# Altium schematic sheet Блок3.SchDoc
size A4
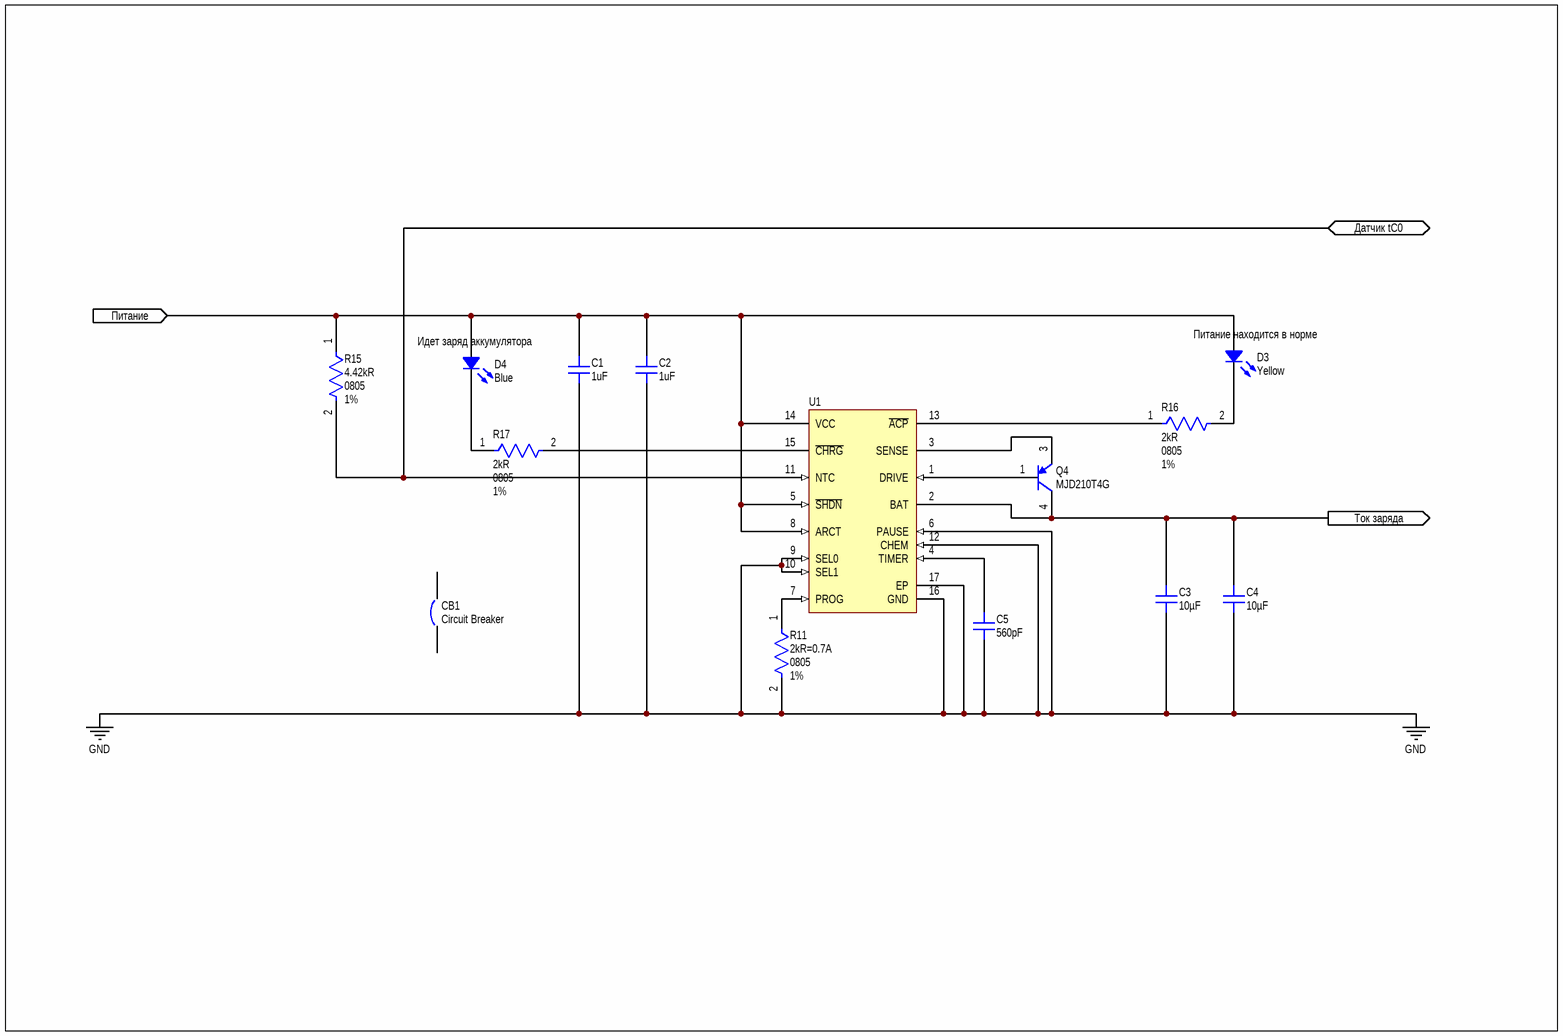
[diagram p0: Блок3.SchDoc]

## Parts
C1  1uF  [CAP 1206_3216 - 1.2MM]
C2  1uF  [CAP 1206_3216 - 1.2MM]
C3  10µF  [CAP 1206_3216 - 1.0MM]
C4  10µF  [CAP 1206_3216 - 1.0MM]
C5  560pF  [CAP 1206_3216 - 0.8MM]
CB1  Circuit Breaker  [SPST-2]
D3  Yellow  Parameter 1: Питание находится в норме  [LED 1206_3216 YELLOW]
D4  Blue  Parameter 1: Идет заряд аккумулятора  [LED 1206_3216 BLUE]
Q4  MJD210T4G  [ONSC-DPAK-3-369C-01_V]
R11  Resistance: 2kR=0.7A  Case/Package: 0805  Tolerance: 1%  [FP-MC01W0805-IPC_C]  (hidden comment: MC01W0805110K)
R15  Resistance: 4.42kR  Case/Package: 0805  Tolerance: 1%  [FP-MC01W0805-IPC_C]  (hidden comment: MC01W0805110K)
R16  Resistance: 2kR  Case/Package: 0805  Tolerance: 1%  [FP-MC01W0805-IPC_C]  (hidden comment: MC01W0805110K)
R17  Resistance: 2kR  Case/Package: 0805  Tolerance: 1%  [FP-MC01W0805-IPC_C]  (hidden comment: MC01W0805110K)
U1  LTC4060EDHC#PBF  [LT-DHC-16_V]  (value not drawn)

## Ports
Датчик tC0 (bidir), Питание (in), Ток заряда (out)

## Nets
GND: C1.1 C2.1 C3.1 C4.1 C5.1 R11.2 U1.6(PAUSE) U1.9(SEL0) U1.10(SEL1) U1.12(CHEM) U1.16(GND) U1.17(EP)
Датчик tC0: R15.2 U1.11(NTC) ; port Датчик tC0
Питание: C1.2 C2.2 D3.1 D4.1 R15.1 U1.5(~{SHDN}) U1.8(ARCT) U1.14(VCC) ; port Питание
Ток заряда: C3.2 C4.2 Q4.4(C) U1.2(BAT) ; port Ток заряда
NetC5_2: C5.2 U1.4(TIMER)
NetD3_2: D3.2 R16.2
NetD4_2: D4.2 R17.1
NetQ4_1: Q4.1(B) U1.1(DRIVE)
NetQ4_3: Q4.3(E) U1.3(SENSE)
NetR11_1: R11.1 U1.7(PROG)
NetR16_1: R16.1 U1.13(~{ACP})
NetR17_2: R17.2 U1.15(~{CHRG})

Not connected (* = marked no-connect by the designer): CB1 1 2

## Library data of the parts
C1 C2 = C1206C105M5RACTU: CAP CER 1UF 50V X7R 1206; Manufacturer: KEMET; Capacitance: 1µF; Tolerance: ±20%; Part Number: C1206C105M5RACTU; Value: 1uF; Applications: Bypass, Decoupling; ComponentLink1Description: Datasheet; ComponentLink1URL: https://api.kemet.com/component-edge/download/datasheet/C1206C105M5RACTU.pdf; ComponentLink2Description: DigiKey Link; ComponentLink2URL: http://digikey.com/product-detail/en/kemet/C1206C105M5RACTU/399-8151-1-ND/3471874; Device Package: 1206 (3216 Metric); LastUpdated: 02.09.2020 1:05:10; Lifecycle Status: Active; Minimum Order: 1; Mounting Type: Surface Mount, MLCC; Operating Temperature: -55°C ~ 125°C; Package / Case: 1206 (3216 Metric); Packaging: TapeAndReel; PartId: 18886; Part Status: Active; Price: 0.07; Series: SMD Comm X7R; Size / Dimension: 0.126" L x 0.063" W (3.20mm x 1.60mm); Supplier 1: DigiKey; Supplier Part Number 1: 399-8151-1-ND; Temperature Coefficient: X7R; Thickness (Max): 0.043" (1.10mm); Voltage - Rated: 50V
C3 C4 = EMK316BJ106MD-T: CAP CER 10UF 16V X5R 1206; Manufacturer: Taiyo Yuden; Tolerance: ±20%; Part Number: EMK316BJ106MD-T; Value: 10µF; Applications: General Purpose; Capacitance: 10µF; ComponentLink1Description: Datasheet; ComponentLink1URL: http://www.yuden.co.jp/productdata/catalog/mlcc06_e.pdf; ComponentLink2Description: DigiKey Link; ComponentLink2URL: http://digikey.com/product-detail/en/taiyo-yuden/EMK316BJ106MD-T/587-4881-1-ND/6563724; Device Package: 1206 (3216 Metric); LastUpdated: 02.09.2020 1:05:06; Lifecycle Status: Active; Minimum Order: 1; Mounting Type: Surface Mount, MLCC; Operating Temperature: -55°C ~ 85°C; Package / Case: 1206 (3216 Metric); Packaging: TapeAndReel; PartId: 18996; Part Status: Active; Price: 0.05; Series: M; Size / Dimension: 0.126" L x 0.063" W (3.20mm x 1.60mm); Supplier 1: DigiKey; Supplier Part Number 1: 587-4881-1-ND; Temperature Coefficient: X5R; Thickness (Max): 0.037" (0.95mm); Voltage - Rated: 16V
C5 = CC1206JRNPO9BN561: CAP CER 560PF 50V NPO 1206; Manufacturer: Yageo; Temperature Coefficient: C0G, NP0; Tolerance: ±5%; Part Number: CC1206JRNPO9BN561; Value: 560pF; Applications: General Purpose; Capacitance: 560pF; ComponentLink1Description: Datasheet; ComponentLink1URL: https://www.yageo.com/upload/media/product/productsearch/datasheet/mlcc/UPY-GP_NP0_16V-to-50V_17.pdf; ComponentLink2Description: DigiKey Link; ComponentLink2URL: http://digikey.com/product-detail/en/yageo/CC1206JRNPO9BN561/311-4422-1-ND/8025511; Device Package: 1206 (3216 Metric); LastUpdated: 02.09.2020 1:04:45; Lifecycle Status: Active; Minimum Order: 1; Mounting Type: Surface Mount, MLCC; Operating Temperature: -55°C ~ 125°C; Package / Case: 1206 (3216 Metric); Packaging: TapeAndReel; PartId: 18850; Part Status: Active; Price: 0.05; Series: CC; Size / Dimension: 0.126" L x 0.063" W (3.20mm x 1.60mm); Supplier 1: DigiKey; Supplier Part Number 1: 311-4422-1-ND; Thickness (Max): 0.028" (0.70mm); Voltage - Rated: 50V
D3 = APTD3216SYCK: LED YELLOW CLEAR 2SMD; Manufacturer: Kingbright; Configuration: Standard; Current - Test: 20mA; Lens Color: Colorless; Lens Size: 1.60mm Dia; Lens Style: Round with Domed Top; Millicandela Rating: 800mcd; Viewing Angle: 35°; Voltage - Forward (Vf) (Typ): 2V; Wavelength - Dominant: 590nm; Part Number: APTD3216SYCK; Color: Yellow; ComponentLink1Description: Datasheet; ComponentLink1URL: http://www.kingbrightusa.com/images/catalog/SPEC/APTD3216SYCK.pdf; ComponentLink2Description: DigiKey Link; ComponentLink2URL: http://digikey.com/product-detail/en/kingbright/APTD3216SYCK/754-1160-1-ND/1747877; Device Package: 1206 (3216 Metric); Height (Max): 1.90mm; LastUpdated: 02.09.2020 1:21:25; Lens Transparency: Clear; Lifecycle Status: Active; Minimum Order: 1; Mounting Type: Surface Mount; Package / Case: 1206 (3216 Metric); Packaging: TapeAndReel; PartId: 38; Part Status: Active; Price: 0.10; Series: -; Size / Dimension: 3.20mm L x 1.60mm W; Supplier 1: DigiKey; Supplier Part Number 1: 754-1160-1-ND; Supplier Device Package: 2-SMD; Value: Yellow; Wavelength - Peak: 590nm
D4 = IN-S126ATB: LED BLUE CLEAR 1206 SMD; Manufacturer: Inolux; Configuration: Standard; Current - Test: 20mA; Lens Size: 2.00mm x 1.50mm; Lens Style: Rectangle with Flat Top; Millicandela Rating: 140mcd; Viewing Angle: 120°; Voltage - Forward (Vf) (Typ): 3.2V; Wavelength - Dominant: 468nm; Wavelength - Peak: 472nm; Part Number: IN-S126ATB; Color: Blue; ComponentLink1Description: Datasheet; ComponentLink1URL: http://www.inolux-corp.com/datasheet/SMDLED/Mono%20Color%20Top%20View/IN-S126AT%20Series_V1.0.pdf; ComponentLink2Description: DigiKey Link; ComponentLink2URL: http://digikey.com/product-detail/en/inolux/IN-S126ATB/1830-1088-1-ND/7604680; Device Package: 1206 (3216 Metric); Height (Max): 1.10mm; LastUpdated: 02.09.2020 1:20:34; Lens Color: Clear; Lens Transparency: Clear; Lifecycle Status: Active; Minimum Order: 1; Mounting Type: Surface Mount; Package / Case: 1206 (3216 Metric); Packaging: TapeAndReel; PartId: 723; Part Status: Active; Price: 0.07; Series: IN-S126AT; Size / Dimension: 3.20mm L x 1.50mm W; Supplier 1: DigiKey; Supplier Part Number 1: 1830-1088-1-ND; Supplier Device Package: 1206; Value: Blue
Q4 = CMP-1048-00154-1: Complementary Plastic Power Transistor, PNP Silicon, 3-Pin DPAK, Pb-Free, Tape and Reel; Manufacturer: On Semiconductor; fT Min (MHz): 65; IC Continuous (A): 5; ComponentLink1URL: http://www.onsemi.com/; Mounting Technology: Surface Mount; ComponentLink3Description: Package Specification; PackageReference: DPAK-3-369C-01; DatasheetVersion: Rev. 13; ComponentLink2URL: http://www.onsemi.cn/pub_link/Collateral/MJD200-D.PDF; ComponentLink3URL: http://www.onsemi.cn/pub_link/Collateral/369C.PDF; Packing: Tape and Reel; PackageDescription: 3-Pin Flange Mount, Body 6.54 x 6.095 mm, Pitch 2.29 mm; PartNumber: MJD210T4G; Polarity: PNP; RoHS: TRUE; PackageVersion: Rev. E, 02/2014; ComponentLink2Description: Datasheet; ComponentLink1Description: Manufacturer URL
R11 R15-R17 = CMP-12256-000003-1: Resistor, 10K, 0.1W, 1%, 0805, Reel; Manufacturer: Multicomp; Voltage Rating: 150V; Temperature Coefficient: 100ppm/°C; Power Rating: 100mW; REACH SVHC: No SVHC; Composition: Thick Film; Max Operating Temperature: 155°C; Number of Pins: 2; Case Code (Metric): 2012; Voltage Rating (DC): 150V; Min Operating Temperature: -55°C; Width: 1.25mm; Case Code (Imperial): 0805; Packaging: Cut Tape; Supplier 1: Newark; Supplier Part Number 1: 07W5303; Manufacturer Part Number: MC01W0805110K; RoHS: No; Category: Chip SMD Resistors; Stock 1: 940000; Pricing 1: 1=0,00900, 5000=0,00900, 10000=0,00800, 25000=0,00600 (USD); Series: MC; Resistor Type: Thick Film; Resistance Tolerance: 1%; RoHS Compliant: No; ComponentLink1URL: https://datasheet.ciiva.com/7881/1729047-7881334.pdf?src-supplier=Element14; ComponentLink1Description: https://datasheet.ciiva.com/7881/1729047-7881334.pdf?src-supplier=Element14; ComponentLink2URL: https://datasheet.ciiva.com/7881/1729047-7881333.pdf?src-supplier=Element14; ComponentLink2Description: https://datasheet.ciiva.com/7881/1729047-7881333.pdf?src-supplier=Element14
U1 = CMP-0471-00160-1: Standalone Linear NiMH / NiCd Fast Battery Charger, 4.5 to 10 V Vin, 16-pin SON (DHC-16), -40 to 85 degC, Pb-Free; Manufacturer: Linear Technology; Float Voltage: Adj; Vin Min(V): 4.5; Max Charge Current(A): 2; Battery Chemistry: NiCd, NiMH, Lead Acid; Number of Cells: 1 to 4; Vin Max(V): 10; PartNumber: LTC4060EDHC#PBF; PackageVersion: Jun-10; ComponentLink1URL: http://www.linear.com/; ComponentLink3Description: Package Specification; RoHS: TRUE; PackageReference: DHC-16; ComponentLink2Description: Datasheet; Mounting Technology: Surface Mount; PackageDescription: 16-Pin Plastic DFN, Body 5 x 3 mm, Pitch 0.5 mm; ComponentLink1Description: Manufacturer URL; Type of Charger: Linear; ComponentLink2URL: http://cds.linear.com/docs/en/datasheet/4060f.pdf; ComponentLink3URL: http://cds.linear.com/docs/en/packaging/DFN_16_05-08-1706.pdf; Code_JEDEC: MO-229
CB1 = Circuit Breaker: Published: 24-Mar-1999; LatestRevisionDate: 17-Jul-2002; LatestRevisionNote: Re-released for DXP Platform.; PackageReference: SPST-2; Publisher: Altium Limited; PackageDescription: Switch; 2 Leads